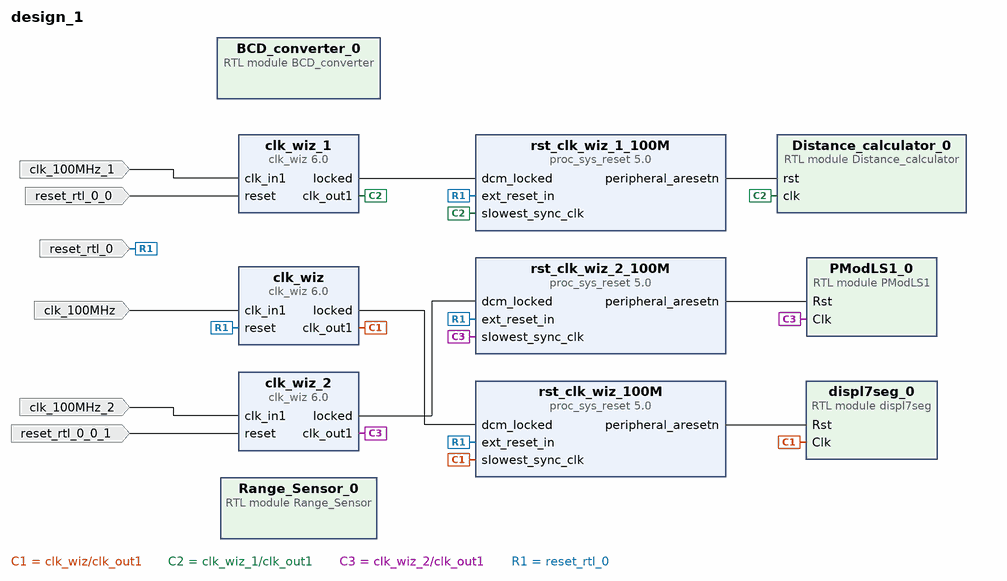
[diagram p0: block diagram of the top level]
# Vivado block design design_1, xc7a100tcsg324-1, Vivado 2020.1
create_bd_design design_1

create_bd_port -dir I -type clk clk_100MHz
set_property -dict {CONFIG.FREQ_HZ 100000000} [get_bd_ports clk_100MHz]
create_bd_port -dir I -type rst reset_rtl_0
set_property -dict {CONFIG.POLARITY ACTIVE_HIGH} [get_bd_ports reset_rtl_0]
create_bd_port -dir I -type clk clk_100MHz_1
set_property -dict {CONFIG.FREQ_HZ 100000000} [get_bd_ports clk_100MHz_1]
create_bd_port -dir I -type rst reset_rtl_0_0
set_property -dict {CONFIG.POLARITY ACTIVE_HIGH} [get_bd_ports reset_rtl_0_0]
create_bd_port -dir I -type clk clk_100MHz_2
set_property -dict {CONFIG.FREQ_HZ 100000000} [get_bd_ports clk_100MHz_2]
create_bd_port -dir I -type rst reset_rtl_0_0_1
set_property -dict {CONFIG.POLARITY ACTIVE_HIGH} [get_bd_ports reset_rtl_0_0_1]

create_bd_cell -type module -reference PModLS1 PModLS1_0
create_bd_cell -type module -reference displ7seg displ7seg_0
create_bd_cell -type module -reference Range_Sensor Range_Sensor_0
create_bd_cell -type module -reference BCD_converter BCD_converter_0
create_bd_cell -type module -reference Distance_calculator Distance_calculator_0
create_bd_cell -type ip -vlnv xilinx.com:ip:clk_wiz:6.0 clk_wiz
create_bd_cell -type ip -vlnv xilinx.com:ip:proc_sys_reset:5.0 rst_clk_wiz_100M
create_bd_cell -type ip -vlnv xilinx.com:ip:clk_wiz:6.0 clk_wiz_1
create_bd_cell -type ip -vlnv xilinx.com:ip:proc_sys_reset:5.0 rst_clk_wiz_1_100M
create_bd_cell -type ip -vlnv xilinx.com:ip:clk_wiz:6.0 clk_wiz_2
create_bd_cell -type ip -vlnv xilinx.com:ip:proc_sys_reset:5.0 rst_clk_wiz_2_100M

# ---- connections ----

connect_bd_net [get_bd_pins clk_wiz/clk_out1] [get_bd_pins displ7seg_0/Clk] [get_bd_pins rst_clk_wiz_100M/slowest_sync_clk]
connect_bd_net [get_bd_pins clk_wiz/locked] [get_bd_pins rst_clk_wiz_100M/dcm_locked]
connect_bd_net [get_bd_pins rst_clk_wiz_100M/peripheral_aresetn] [get_bd_pins displ7seg_0/Rst]
connect_bd_net [get_bd_pins clk_wiz_1/clk_out1] [get_bd_pins Distance_calculator_0/clk] [get_bd_pins rst_clk_wiz_1_100M/slowest_sync_clk]
connect_bd_net [get_bd_pins clk_wiz_1/locked] [get_bd_pins rst_clk_wiz_1_100M/dcm_locked]
connect_bd_net [get_bd_pins rst_clk_wiz_1_100M/peripheral_aresetn] [get_bd_pins Distance_calculator_0/rst]
connect_bd_net [get_bd_pins clk_wiz_2/clk_out1] [get_bd_pins PModLS1_0/Clk] [get_bd_pins rst_clk_wiz_2_100M/slowest_sync_clk]
connect_bd_net [get_bd_pins clk_wiz_2/locked] [get_bd_pins rst_clk_wiz_2_100M/dcm_locked]
connect_bd_net [get_bd_pins rst_clk_wiz_2_100M/peripheral_aresetn] [get_bd_pins PModLS1_0/Rst]
connect_bd_net [get_bd_ports clk_100MHz] [get_bd_pins clk_wiz/clk_in1]
connect_bd_net -net reset_rtl_0_1 [get_bd_ports reset_rtl_0] \
  [get_bd_pins clk_wiz/reset] [get_bd_pins rst_clk_wiz_1_100M/ext_reset_in] [get_bd_pins rst_clk_wiz_2_100M/ext_reset_in] \
  [get_bd_pins rst_clk_wiz_100M/ext_reset_in]
connect_bd_net -net clk_100MHz_1_1 [get_bd_ports clk_100MHz_1] [get_bd_pins clk_wiz_1/clk_in1]
connect_bd_net -net reset_rtl_0_0_1 [get_bd_ports reset_rtl_0_0] [get_bd_pins clk_wiz_1/reset]
connect_bd_net -net clk_100MHz_2_1 [get_bd_ports clk_100MHz_2] [get_bd_pins clk_wiz_2/clk_in1]
connect_bd_net -net reset_rtl_0_0_1_1 [get_bd_ports reset_rtl_0_0_1] [get_bd_pins clk_wiz_2/reset]

validate_bd_design
save_bd_design
